# EAGLE design minutka_hlavni_v2 (EAGLE 9.6.2)
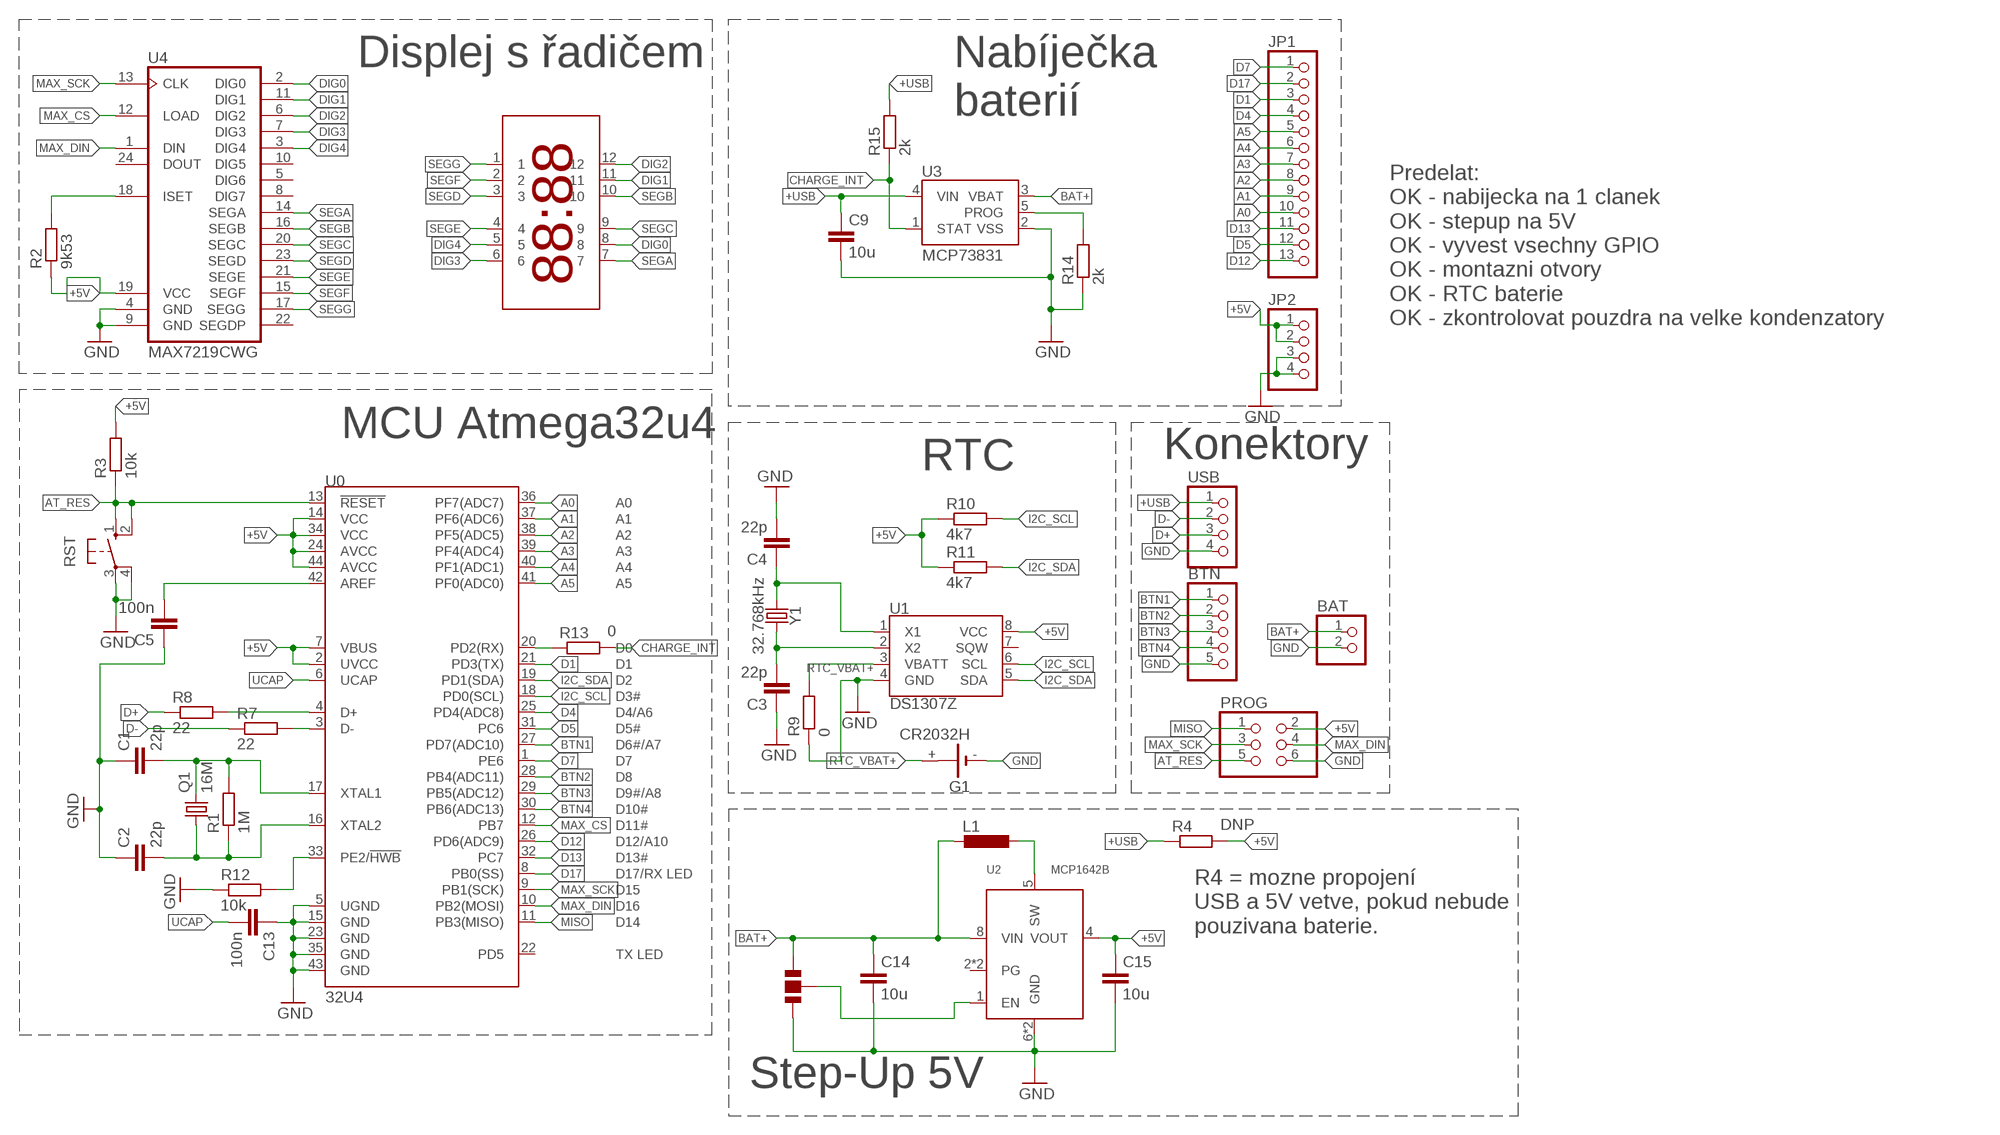
[diagram p0: schematic, sheet 1]

## Parts
BAT  PINHD-1X2  [1X02]
BTN  PINHD-1X5  [1X05]
C1  22p  C-EUC0603  [C0603]
C2  22p  C-EUC0603  [C0603]
C3  22p  C-EUC0603  [C0603]
C4  22p  C-EUC0603  [C0603]
C5  100n  C-EUC0603  [C0603]
C9  10u  C-EUC1206  [C1206]
C13  100n  C-EUC0603  [C0603]
C14  10u  C-EUC1206  [C1206]
C15  10u  C-EUC1206  [C1206]
G1  CR2032H  [CR2032H]
JP1  PINHD-1X13  [1X13]
JP2  PINHD-1X4  [1X04]
L1  L-EUL4532P  [L4532P]
PROG  PINHD-2X3  [2X03]
Q1  16M  CRYSTALHC49UP  [HC49UP]
R1  1M  R-EU_R0603  [R0603]
R2  9k53  R-EU_R0603  [R0603]
R3  10k  R-EU_R0603  [R0603]
R4  DNP  R-EU_R0603  [R0603]
R7  22  R-EU_R0603  [R0603]
R8  22  R-EU_R0603  [R0603]
R9  0  R-EU_R0603  [R0603]
R10  4k7  R-EU_R0603  [R0603]
R11  4k7  R-EU_R0603  [R0603]
R12  10k  R-EU_R0603  [R0603]
R13  0  R-EU_R0603  [R0603]
R14  2k  R-EU_R0603  [R0603]
R15  2k  R-EU_R0603  [R0603]
RST  10-XX  [B3F-10XX]
U0  32U4  ATMEGA32U4TQFP-44  [TQFP44]
U1  DS1307Z  [SO08-0.15]
U2  MCP1642B  [MSOP8]
U3  MCP73831  [SOT95P290X120-5]
U4  MAX7219CWG  [SO24L]
U$2  KW4-8828AVB  [KW4-8828AVB]
U$7  JUMPER  [2-WAY]
USB  PINHD-1X4  [1X04]
Y1  32.768kHz  CRYSTAL-32.768KHZSMD-2X6  [CRYSTAL-SMD-2X6-CYL]

## Nets
+5V: C15.1 JP2.1 JP2.2 PROG.2 R2.1 R3.2 R4.2 R10.1 R11.1 U0.2(UVCC) U0.7(VBUS) U0.14(VCC) U0.24(AVCC) U0.34(VCC) U0.44(AVCC) U1.8(VCC) U2.4(VOUT) U4.19(VCC)
+USB: C9.1 R4.1 R15.2 U3.4(VIN) USB.1
A0: JP1.10 U0.36(PF7(ADC7))
A1: JP1.9 U0.37(PF6(ADC6))
A2: JP1.8 U0.38(PF5(ADC5))
A3: JP1.7 U0.39(PF4(ADC4))
A4: JP1.6 U0.40(PF1(ADC1))
A5: JP1.5 U0.41(PF0(ADC0))
AT_RES: PROG.5 R3.1 RST.1(S) RST.2(S1) U0.13(!RESET)
BAT+: BAT.1 C14.1 L1.2 U2.8(VIN) U3.3(VBAT) U$7.P$2
BTN1: BTN.1 U0.27(PD7(ADC10))
BTN2: BTN.2 U0.28(PB4(ADC11))
BTN3: BTN.3 U0.29(PB5(ADC12))
BTN4: BTN.4 U0.30(PB6(ADC13))
CHARGE_INT: R13.2 R15.1 U3.1(STAT)
D1: JP1.3 U0.21(PD3(TX))
D4: JP1.4 U0.25(PD4(ADC8))
D5: JP1.12 U0.31(PC6)
D7: JP1.1 U0.1(PE6)
D12: JP1.13 U0.26(PD6(ADC9))
D13: JP1.11 U0.32(PC7)
D17: JP1.2 U0.8(PB0(SS))
D+: R8.1 USB.3
D-: R7.1 USB.2
DIG0: U4.2(DIG0) U$2.8
DIG1: U4.11(DIG1) U$2.11
DIG2: U4.6(DIG2) U$2.12
DIG3: U4.7(DIG3) U$2.6
DIG4: U4.3(DIG4) U$2.5
GND: BAT.2 BTN.5 C1.1 C2.1 C3.1 C4.2 C5.1 C9.2 C13.1 C14.2 C15.2 G1.- JP2.3 JP2.4 PROG.6 R9.1 R12.1 R14.1 RST.3(P) RST.4(P1) U0.5(UGND) U0.15(GND) U0.23(GND) U0.35(GND) U0.43(GND) U1.4(GND) U2.6(GND) U2.7(GND) U3.2(VSS) U4.4(GND) U4.9(GND) U$7.P$3 USB.4
I2C_SCL: R10.2 U0.18(PD0(SCL)) U1.6(SCL)
I2C_SDA: R11.2 U0.19(PD1(SDA)) U1.5(SDA)
MAX_CS: U0.12(PB7) U4.12(LOAD)
MAX_DIN: PROG.4 U0.10(PB2(MOSI)) U4.1(DIN)
MAX_SCK: PROG.3 U0.9(PB1(SCK)) U4.13(CLK)
MISO: PROG.1 U0.11(PB3(MISO))
N$1: C1.2 Q1.2 R1.2 U0.17(XTAL1)
N$2: C2.2 Q1.1 R1.1 U0.16(XTAL2)
N$3: C4.1 U1.1(X1) Y1.X1
N$4: C3.2 U1.2(X2) Y1.X2
N$7: R2.2 U4.18(ISET)
N$8: C5.2 U0.42(AREF)
N$10: R8.2 U0.4(D+)
N$11: R7.2 U0.3(D-)
N$13: R12.2 U0.33(PE2/!HWB)
N$17: R13.1 U0.20(PD2(RX))
N$18: R14.2 U3.5(PROG)
N$21: L1.1 U2.5(SW)
N$23: U2.1(EN) U$7.P$1
RTC_VBAT+: G1.+ R9.2 U1.3(VBATT)
SEGA: U4.14(SEGA) U$2.7
SEGB: U4.16(SEGB) U$2.10
SEGC: U4.20(SEGC) U$2.9
SEGD: U4.23(SEGD) U$2.3
SEGE: U4.21(SEGE) U$2.4
SEGF: U4.15(SEGF) U$2.2
SEGG: U4.17(SEGG) U$2.1
UCAP: C13.2 U0.6(UCAP)
Unconnected: G1.+@1(+) U0.22(PD5) U1.7(SQW) U2.2(PG) U2.3(PG) U4.5(DIG6) U4.8(DIG7) U4.10(DIG5) U4.22(SEGDP) U4.24(DOUT)

## Notes on the sheet
- Displej s řadičem
- Nabíječka
  baterií
- Predelat:
  OK - nabijecka na 1 clanek
  OK - stepup na 5V
  OK - vyvest vsechny GPIO
  OK - montazni otvory
  OK - RTC baterie
  OK - zkontrolovat pouzdra na velke kondenzatory
- MCU Atmega32u4
- RTC | Konektory
- R4 = mozne propojení
  USB a 5V vetve, pokud nebude
  pouzivana baterie.
- Step-Up 5V

## Library data of the parts
BAT = pinhead:PINHD-1X2: PIN HEADER
BTN = pinhead:PINHD-1X5: PIN HEADER
C1-C5 C9 C13-C15 = rcl:C-EU: CAPACITOR, European symbol; SPICEPREFIX: C
G1 = battery:CR2032H: LI BATTERY Varta
JP1 = pinhead:PINHD-1X13: PIN HEADER
JP2 USB = pinhead:PINHD-1X4: PIN HEADER
L1 = rcl:L-EU: INDUCTOR, European symbol; SPICEPREFIX: L
PROG = pinhead:PINHD-2X3: PIN HEADER
Q1 = crystal:CRYSTAL: CRYSTAL; OC_FARNELL: unknown; OC_NEWARK: unknown
R1-R4 R7-R15 = rcl:R-EU_: RESISTOR, European symbol; SPICEPREFIX: R
RST = switch-omron:10-XX: OMRON SWITCH; MPN: B3F-1000; OC_FARNELL: 176432; OC_NEWARK: 36M3542
U0 = SparkFun-IC-Microcontroller:ATMEGA32U4: Atmel MCU, 32KByte Atmel 44-pin 8-bit Microcontroller with 32KBytes of ISP Flash and USB Controller Datasheet <http://cdn.sparkfun.com/datasheets/Dev/Arduino/Boards/ATMega32U4.pdf> SparkFun Products LilyPad Arduino USB - ATmega32U4 Board <https://www.sparkfun.com/products/12049> (DEV-12049) Pro Micro - 5V/16MHz <https://www.sparkfun.com/products/12640> (DEV-12640) Pro Micro - 3.3V/8MHz <https://www.sparkfun.com/products/12587> (DEV-12587) Fio v3 - ATmega32U4 <https://www.sparkfun.com/products/11520> (DEV-11520) Qduino Mini <https://www.sparkfun.com/products/13614> (DEV-13614) Makey Makey - Standard Kit <https://www.sparkfun.com/products/11511> (WIG-11511) Makey Makey Deluxe Kit <https://www.sparkfun.com/products/11519> (WIG-11519); PROD_ID: IC-11161
U1 = SparkFun-Clocks:DS1307: Maxim DS1307 - I2C Real-time clock (RTC) The DS1307 serial real-time clock (RTC) is a low-power, full binary-coded decimal (BCD) clock/calendar plus 56 bytes of NV SRAM. Address and data are transferred serially through an I2C, bidirectional bus. The clock/calendar provides seconds, minutes, hours, day, date, month, and year information. SparkFun Products: Real Time Clock Module <https://www.sparkfun.com/products/12708> (BOB-12708) Datasheet <https://cdn.sparkfun.com/datasheets/BreakoutBoards/DS1307.pdf>; PROD_ID: IC-08138
U2 = bastlir:MCP1642B
U3 = bastlir:MCP73831
U4 = bastlir:MAX7219CWG
U$2 = bastlir:KW4-8828AVB: Displej sedmisegmentový 4 číslice 0,94" https://www.tme.eu/cz/details/kw4-8828avb/ctyrmistne-led-displeje/lucky-light/
U$7 = czech_maker:JUMPER
Y1 = SparkFun-Clocks:CRYSTAL-32.768KHZ: 32.768kHz Crystal Frequency: 32.768kHz Frequency Stability: ±20ppm Load Capacitance: 12.5pF (PTH-2X6 & SMD-3.2X1.5), 6pF (SMD-2X6) SparkFun Products: SparkFun BigTime Watch Kit <https://www.sparkfun.com/products/11734> SparkFun nRF52832 Breakout <https://www.sparkfun.com/products/13990> SparkFun Real Time Clock Module <https://www.sparkfun.com/products/12708>; PROD_ID: XTAL-07894

## Board
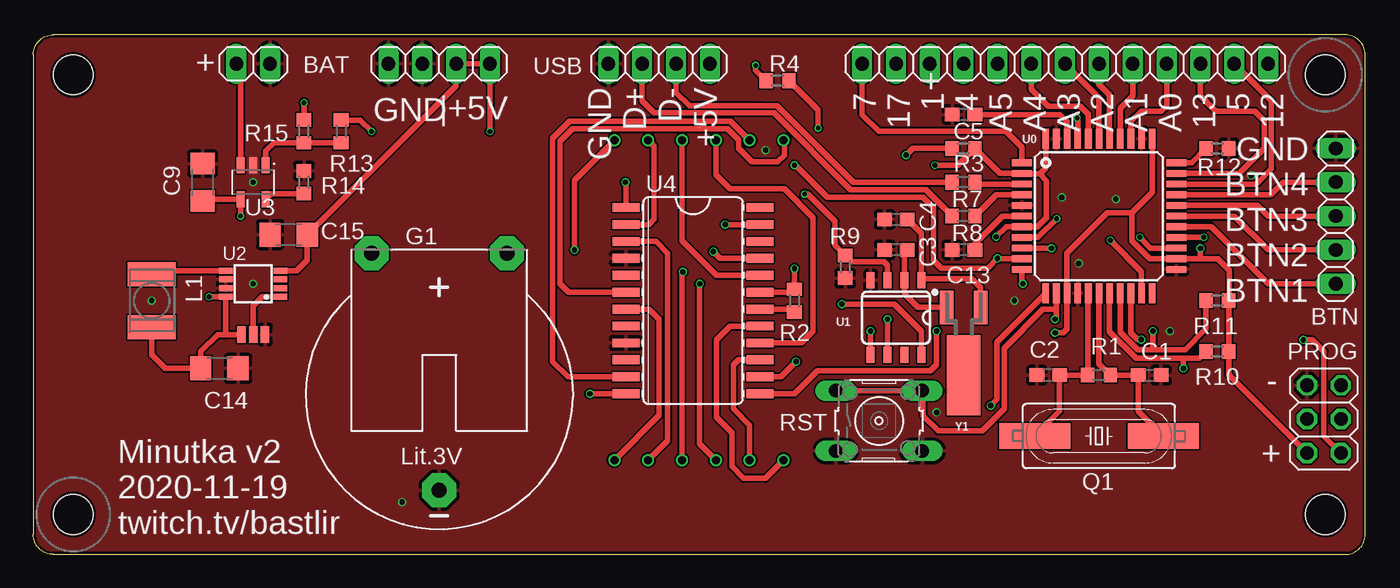
[diagram p1: board, top side]
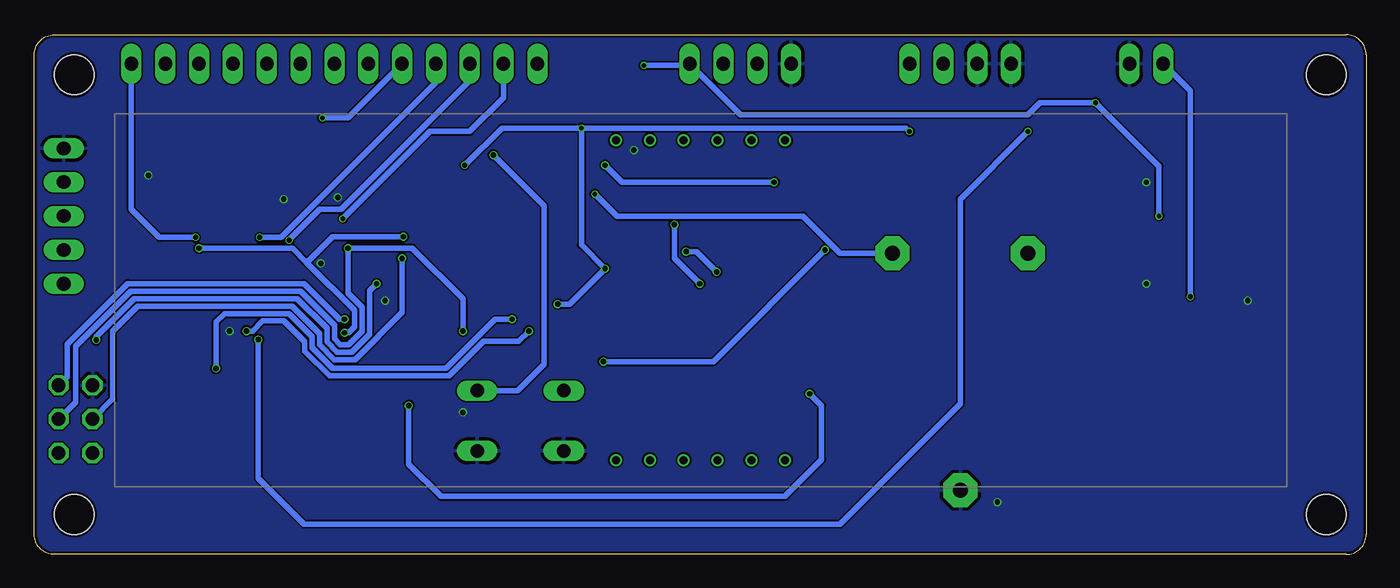
[diagram p2: board, bottom side, seen from below]

Size 100 x 39 mm. Coordinates in mm from the lower left corner, seen from the top.
Outline: 1.5,0 98.5,0 arc90 100,1.5 100,37.5 arc90 98.5,39 1.5,39 arc90 0,37.5 0,1.5 arc90 1.5,0
Copper layers (1*16): Top 0.035559375mm / dielectric 1.6mm / Bottom 0.035559375mm
Design rules "jlcpcb2layer": minimum track width 5mil, minimum drill 12mil, track to track 5mil, track to pad 5mil, pad to pad 5mil, via to via 5mil, smd to smd 5mil, copper to edge 8mil, drill to drill 6mil, minimum pad ring 5mil, minimum via ring 3mil, stop-mask expansion 2.5mil, vias tented up to drill 0mil, thermal gap 10mil
Holes 3 mm at 3,3 3,36 97,36 97,3

### Footprints (pad centres in the part's own frame; a part is rotated, then mirrored left to right if it is on the bottom)
1X02 = drill 1.016 long: 1 -1.27,0; 2 1.27,0
1X05 = drill 1.016 long: 1 -5.08,0; 2 -2.54,0; 3 0,0; 4 2.54,0; 5 5.08,0
C0603 = smd 1.1 x 1: 1 -0.85,0; 2 0.85,0
C1206 = smd 1.6 x 1.8: 1 -1.4,0; 2 1.4,0
CR2032H = drill 1.118 pad 2.54 octagon: + 5.08,10.795; +@1 -5.08,10.795; - 0,-6.985
1X13 = drill 1.016 long: 1 -15.24,0; 2 -12.7,0; 3 -10.16,0; 4 -7.62,0; 5 -5.08,0; 6 -2.54,0; 7 0,0; 8 2.54,0; 9 5.08,0; 10 7.62,0; 11 10.16,0; 12 12.7,0; 13 15.24,0
1X04 = drill 1.016 long: 1 -3.81,0; 2 -1.27,0; 3 1.27,0; 4 3.81,0
L4532P = smd 1.8 x 3.6: 1 -2,0; 2 2,0
2X03 = drill 1.016 octagon: 1 -2.54,-1.27; 2 -2.54,1.27; 3 0,-1.27; 4 0,1.27; 5 2.54,-1.27; 6 2.54,1.27
HC49UP = smd 5.334 x 1.93: 1 -4.826,0; 2 4.826,0
R0603 = smd 1 x 1.1: 1 -0.85,0; 2 0.85,0
B3F-10XX = drill 1.016 long: 1 -3.251,2.261; 2 3.251,2.261; 3 -3.251,-2.261; 4 3.251,-2.261
TQFP44 = smd 1.5 x 0.5: 1 -5.8,4; 2 -5.8,3.2; 3 -5.8,2.4; 4 -5.8,1.6; 5 -5.8,0.8; 6 -5.8,0; 7 -5.8,-0.8; 8 -5.8,-1.6; 9 -5.8,-2.4; 10 -5.8,-3.2; 11 -5.8,-4; 23 5.8,-4; 24 5.8,-3.2; 25 5.8,-2.4; 26 5.8,-1.6; 27 5.8,-0.8; 28 5.8,0; 29 5.8,0.8; 30 5.8,1.6; 31 5.8,2.4; 32 5.8,3.2; 33 5.8,4 | smd 0.5 x 1.5: 12 -4,-5.8; 13 -3.2,-5.8; 14 -2.4,-5.8; 15 -1.6,-5.8; 16 -0.8,-5.8; 17 0,-5.8; 18 0.8,-5.8; 19 1.6,-5.8; 20 2.4,-5.8; 21 3.2,-5.8; 22 4,-5.8; 34 4,5.8; 35 3.2,5.8; 36 2.4,5.8; 37 1.6,5.8; 38 0.8,5.8; 39 0,5.8; 40 -0.8,5.8; 41 -1.6,5.8; 42 -2.4,5.8; 43 -3.2,5.8; 44 -4,5.8
SO08-0.15 = smd 0.6 x 1.2: 1 -1.905,-2.8; 2 -0.635,-2.8; 3 0.635,-2.8; 4 1.905,-2.8; 5 1.905,2.8; 6 0.635,2.8; 7 -0.635,2.8; 8 -1.905,2.8
MSOP8 = smd 0.45 x 1: 1 -0.975,-2.05; 2 -0.325,-2.05; 3 0.325,-2.05; 4 0.975,-2.05; 5 0.975,2.05; 6 0.325,2.05; 7 -0.325,2.05; 8 -0.975,2.05
SOT95P290X120-5 = smd 1.18 x 0.609: 1 -1.274,0.95; 2 -1.274,0; 3 -1.274,-0.95; 4 1.274,-0.95; 5 1.274,0.95
SO24L = smd 0.66 x 2.032: 1 -6.985,-5.029; 2 -5.715,-5.029; 3 -4.445,-5.029; 4 -3.175,-5.029; 5 -1.905,-5.029; 6 -0.635,-5.029; 7 0.635,-5.029; 8 1.905,-5.029; 9 3.175,-5.029; 10 4.445,-5.029; 11 5.715,-5.029; 12 6.985,-5.029; 13 6.985,5.029; 14 5.715,5.029; 15 4.445,5.029; 16 3.175,5.029; 17 1.905,5.029; 18 0.635,5.029; 19 -0.635,5.029; 20 -1.905,5.029; 21 -3.175,5.029; 22 -4.445,5.029; 23 -5.715,5.029; 24 -6.985,5.029
KW4-8828AVB = drill 0.6: 1 -6.8,-11.97; 2 -4.26,-11.97; 3 -1.72,-11.97; 4 0.82,-11.97; 5 3.36,-11.97; 6 5.9,-11.97; 7 5.9,12.03; 8 3.36,12.03; 9 0.82,12.03; 10 -1.72,12.03; 11 -4.26,12.03; 12 -6.8,12.03
2-WAY = smd 0.635 x 1.27: P$1 0,0; P$2 0.889,0; P$3 -0.889,0
CRYSTAL-SMD-2X6-CYL = smd 2.5 x 6: SHEILD 0,5.08 | smd 1 x 2.5: X1 -1.27,0; X2 1.27,0

### Placement (x,y rotation side)
BAT  16.51,36.83 0 top
BTN  97.79,25.4 90 top
C1  83.82,13.46 180 top
C2  76.2,13.46 0 top
C3  64.77,22.86 0 top
C4  64.77,25.15 180 top
C5  69.85,33.02 0 top
C9  12.7,27.94 90 top
C13  69.85,22.86 0 top
C14  13.97,13.97 0 top
C15  19.18,24 180 top
G1  30.48,11.81 0 top
JP1  77.47,36.83 0 top
JP2  30.48,36.83 180 top
L1  8.89,19.05 270 top
PROG  96.9,10.16 90 top
Q1  80.01,8.89 0 top
R1  80.01,13.46 0 top
R2  57.15,19.05 270 top
R3  69.85,30.48 0 top
R4  55.88,35.56 0 top
R7  69.85,27.94 0 top
R8  69.85,25.4 0 top
R9  60.96,21.59 90 top
R10  88.9,15.24 180 top
R11  88.9,19.05 180 top
R12  88.9,30.48 180 top
R13  23.11,31.75 270 top
R14  20.32,27.94 270 top
R15  20.32,31.75 90 top
RST  63.5,10.03 0 top
U0  80.01,25.4 0 top
U1  64.77,17.78 180 top
U2  16.51,20.32 90 top
U3  16.51,27.94 270 top
U4  49.53,19.05 270 top
U$2  49.53,19.05 0 bottom
U$7  16.51,16.51 180 top
USB  46.99,36.83 180 top
Y1  69.85,18.54 180 top

### Tracks (layer width: path | path; a pad name or v marks a point on that pad's centre or on a via)
+5V  (via drill 0.35, 0.4)
  Top 0.406: U4.19 56.94,19.68 R2.1 v57.15,21.46 | U1.8 66.67,16.76 64.64,18.8 v60.71,18.8 | 87.63,22.2 U0.24 83.84,22.2 82.49,23.56 82.49,25.65 | 87.63,22.2 88.92,22.2 89.79,21.34 89.79,19.09 R11.1 R10.1 89.75,13.5 PROG.2 | v76.71,16.64 77.34,16.64 77.61,16.9 U0.14 77.61,22.62 80.64,25.65 82.49,25.65 | v87.63,22.99 87.63,22.2 | U0.44 76.01,29.02 75.56,28.57 | 75.56,28.57 74.23,28.57 U0.2 72.58,28.6 R3.2 69.43,29.21 v67.69,29.21 | 75.56,28.57 76.07,28.07 76.07,25.27 75.4,24.6 U0.7 73.04,24.6 v72.29,23.85 | U0.34 84.01,27.18 82.49,25.65 | U2.4 19.77,21.3 20.58,22.1 C15.1 31.75,35.18 JP2.2 JP2.1 v34.29,31.75 | R4.2 58.93,33.36 v58.93,32
  Bottom 0.406: v60.71,18.8 59.82,18.8 v57.15,21.46 58.93,23.24 v58.93,32 | 79.54,21.91 75.95,18.32 75.95,17.09 76.4,16.64 v76.71,16.64 | 79.54,21.91 80.62,22.99 v87.63,22.99 | v72.29,23.85 77.6,23.85 79.54,21.91 | v34.29,31.75 34.54,32 v58.93,32 | v58.93,32 64.9,32 v67.69,29.21
+USB  (via drill 0.35)
  Top 0.406: C9.1 12.82,26.67 U3.4 v15.56,25.4 | R4.1 54.23,36.36 v54.23,36.7 | R15.2 v20.32,33.91
  Bottom 0.406: v54.23,36.7 50.93,36.7 USB.1 46.99,33.02 25.4,33.02 24.51,33.91 v20.32,33.91 15.56,29.15 v15.56,25.4
A0
  Top 0.406: JP1.10 85.09,33.66 84.71,33.27 83.19,33.27 82.41,32.5 U0.36
A1
  Top 0.406: JP1.9 82.55,34.42 81.61,33.48 U0.37
A2
  Top 0.406: JP1.8 80.01,35.31 80.81,34.51 U0.38
A3
  Top 0.406: JP1.7 80.01,34.29 U0.39
A4
  Top 0.406: U0.40 79.21,33.06 78.61,33.66 76.2,33.66 74.93,34.92 JP1.6
A5  (via drill 0.35)
  Top 0.406: U0.41 78.41,32.72 v78.36,32.77
  Bottom 0.406: v78.36,32.77 76.45,32.77 JP1.5
AT_RES  (via drill 0.4)
  Top 0.406: U0.13 76.81,18.41 | 76.81,18.41 76.81,17.75 v76.71,17.65 | R3.1 66.04,30.48 v65.53,29.97 | RST.1 RST.2 66.8,12.24 66.8,10.41 67.94,9.27 71.25,9.27 72.9,10.92 72.9,15.49 75.82,18.41 76.81,18.41
  Bottom 0.406: v76.71,17.65 77.09,17.65 79.76,20.32 92.99,20.32 97.54,15.78 97.54,13.34 PROG.5 | v65.53,29.97 61.72,26.16 61.72,14.28 63.7,12.29 RST.2
BAT+  (via drill 0.35)
  Top 0.406: L1.2 8.89,14.99 9.91,13.97 C14.1 12.57,15.24 13.84,16.51 14.61,16.51 | U$7.P$2 14.61,16.51 | 14.61,16.51 14.46,16.66 U2.8 v13.21,19.34 | U3.3 15.56,36.51 BAT.1
  Bottom 0.406: v13.21,19.34 13.21,34.8 BAT.1
BTN1
  Top 0.406: U0.27 88.43,24.6 92.71,20.32 BTN.1
BTN2
  Top 0.406: U0.28 90.17,25.4 92.71,22.86 BTN.2
BTN3
  Top 0.406: U0.29 91.91,26.2 92.71,25.4 BTN.3
BTN4
  Top 0.406: U0.30 92.91,27 93.85,27.94 BTN.4
CHARGE_INT
  Top 0.406: U3.1 17.46,30.29 18.07,30.9 R15.1 R13.2
D1  (via drill 0.35)
  Top 0.406: U0.21 83.21,21.23 v80.86,23.58
  Bottom 0.406: v80.86,23.58 80.86,23.62 78.58,25.91 76.97,25.91 67.31,35.56 JP1.3
D4  (via drill 0.35)
  Top 0.406: U0.25 83.88,23 v83.08,23.8
  Bottom 0.406: v83.08,23.8 81.48,23.8 69.85,35.43 JP1.4
D5
  Top 0.406: U0.31 91.81,27.8 92.96,28.96 92.96,34.04 JP1.12
D7
  Top 0.406: U0.1 74.21,30.57 73.03,31.75 63.5,31.75 62.23,33.02 JP1.1
D12  (via drill 0.35)
  Top 0.406: v87.88,23.8 U0.26
  Bottom 0.406: v87.88,23.8 90.61,23.8 92.71,25.91 JP1.13
D13
  Top 0.406: U0.32 90.55,28.6 92.43,30.48 92.43,32.55 91.7,33.27 88.77,33.27 87.63,34.42 JP1.11
D17  (via drill 0.35)
  Top 0.406: U0.8 75.43,23.8 v76.83,25.2
  Bottom 0.406: v76.83,25.2 70.29,31.75 67.31,31.75 64.77,34.29 JP1.2
D+
  Top 0.406: R8.1 67.02,27.38 61.36,27.38 55.6,33.15 46.61,33.15 45.72,34.04 USB.3
D-
  Top 0.406: R7.1 61.56,27.94 55.82,33.68 54.61,33.68 54.2,33.68 49.25,33.68 48.26,34.67 USB.2
DIG0
  Top 0.406: U4.2 46.23,24.77 46.61,25.15 46.61,30.64 U$2.8
DIG1
  Top 0.406: U$2.11 52.36,32.51 40.26,32.51 38.99,31.24 38.99,14.48 40.13,13.34 U4.11
DIG2
  Top 0.406: U4.6 40.18,19.68 39.55,20.32 39.55,31.01 40.49,31.95 52.12,31.95 52.96,31.11 52.96,30.48 53.98,29.46 55.88,29.46 56.39,29.97 56.39,31.02 U$2.12
DIG3
  Top 0.406: U4.7 46.23,18.41 46.99,17.65 46.99,10.44 U$2.6
DIG4
  Top 0.406: U4.3 46.74,23.5 47.62,22.61 47.62,8.54 U$2.5
GND  (via drill 0.4)
  other vias: 81.28,26.67 67.82,10.67 85.34,16.76 77.22,26.8 73.66,19.05 78.49,21.84 27.69,3.94 16.51,20.32 16.51,27.94 8.89,19.05 54.99,30.35 91.44,28.45
  pour Top: -0.38,-0.38 101.6,-0.38 101.6,39.75 -0.38,39.75
  pour Bottom: -0.64,-0.76 102.87,-0.76 102.87,40.13 -0.64,40.13
I2C_SCL  (via drill 0.4)
  Top 0.406: U0.18 80.81,16.73 82.8,14.73 86.36,14.73 | R10.2 87.54,14.73 86.36,14.73 | 86.36,14.73 v86.36,13.97 | v64.14,17.65 U1.6
  Bottom 0.406: v86.36,13.97 86.36,17.45 85.72,18.09 80.88,18.09 79.14,16.35 79.14,15.5 77.61,13.97 69.09,13.97 65.41,17.65 v64.14,17.65
I2C_SDA  (via drill 0.4)
  Top 0.406: U0.19 81.61,16.69 82.93,15.37 84.07,15.37 | 84.07,15.37 86.49,15.37 88.05,16.93 R11.2 | v84.07,16.76 84.07,15.37 | v62.87,16.76 U1.5
  Bottom 0.406: v84.07,16.76 83.62,16.76 82.86,17.53 81.28,17.53 79.7,15.95 79.7,15.27 77.84,13.41 68.86,13.41 66.27,16 63.63,16 v62.87,16.76
MAX_CS  (via drill 0.4)
  Top 0.406: v41.78,12.06 U4.12 | U0.12 72.34,15.93 72.34,11.63 v71.88,11.18
  Bottom 0.406: v41.78,12.06 40.89,11.18 40.89,7.11 43.64,4.37 69.47,4.37 71.88,6.78 v71.88,11.18
MAX_DIN  (via drill 0.4)
  Top 0.406: U0.10 72.42,22.2 v72.39,22.23 71.66,21.5 68.18,21.5 67.59,22.09 67.59,26.01 66.78,26.82 59.61,26.82 57.22,29.21 v57.15,29.21 | U4.1 44.5,27.89 v44.45,27.94
  Bottom 0.406: PROG.4 94.11,11.68 94.11,16.76 92.23,18.64 80.64,18.64 78.58,16.58 78.58,15.73 77.48,14.63 75.93,14.63 72.39,18.17 v72.39,22.22 v72.39,22.23 | v57.15,29.21 55.88,27.94 v44.45,27.94
MAX_SCK  (via drill 0.4)
  Top 0.406: v76.45,22.99 74.22,22.99 U0.9 | U4.13 57.15,12.06 58.86,13.78 67.37,13.78 67.82,14.22 v67.82,16.76
  Bottom 0.406: PROG.3 96.9,11.43 96.9,15.62 92.76,19.76 80.01,19.76 77.47,17.22 77.47,16.2 77.02,15.75 76.39,15.75 75.39,16.75 75.39,18.55 76.45,19.61 v76.45,22.99 71.63,22.99 67.82,19.18 v67.82,16.76
MISO  (via drill 0.4)
  Top 0.406: PROG.1 96.9,8.89 96.9,15.24 96.04,16.1 v95.35,16.1 | v74.3,20.32 74.21,20.41 U0.11
  Bottom 0.406: v95.35,16.1 95.35,16.35 92.5,19.2 80.26,19.2 78.03,16.96 78.03,15.96 77.25,15.19 76.16,15.19 74.83,16.52 74.83,19.78 v74.3,20.32
N$1
  Top 0.406: Q1.2 82.97,10.76 C1.2 R1.2 80.01,14.31 U0.17
N$2
  Top 0.406: Q1.1 77.05,10.76 C2.2 R1.1 79.16,19.55 U0.16
N$3
  Top 0.406: C4.1 66.67,24.09 U1.1 66.8,20.7 70.48,20.7 71.12,20.07 Y1.X1
N$4
  Top 0.406: C3.2 65.41,22.64 U1.2 65.41,19.56 66.42,18.54 Y1.X2
N$7
  Top 0.406: U4.18 56.94,18.41 R2.2
N$8
  Top 0.406: U0.42 77.61,32.5 77.09,33.02 C5.2
N$10
  Top 0.406: U0.4 72.3,27 R8.2
N$11
  Top 0.406: U0.3 70.84,27.8 R7.2
N$13
  Top 0.406: U0.33 86.97,29.4 R12.2
N$17  (via drill 0.35, 0.4)
  Top 0.406: U0.20 82.41,16.65 82.93,16.13 v83.19,16.13 | R13.1 24.55,32.6 v25.4,31.75
  Bottom 0.406: v83.19,16.13 83.19,5.71 79.76,2.29 39.5,2.29 30.48,11.3 30.48,26.67 v25.4,31.75
N$18
  Top 0.406: U3.5 17.88,27.09 R14.2
N$21
  Top 0.406: L1.1 9.13,21.3 U2.5
N$23
  Top 0.406: U$7.P$1 16.51,18.67 17.19,19.34 U2.1
RTC_VBAT+  (via drill 0.35)
  Top 0.406: U1.3 64.14,21.72 63.88,21.97 61.43,21.97 R9.2 60.2,23.2 60.2,25.02 58.17,27.05 v57.91,27.05
  Bottom 0.406: G1.+ 39.49,22.61 42.28,25.39 56.26,25.39 v57.91,27.05
SEGA  (via drill 0.4)
  Top 0.406: U4.14 56.13,13.34 v57.28,14.48 | v40.64,22.86 40.64,28.09 U$2.7
  Bottom 0.406: v57.28,14.48 49.02,14.48 v40.64,22.86
SEGB
  Top 0.406: U4.16 57.66,15.88 58.55,16.76 58.55,25.27 56.39,27.43 52.32,27.43 51.25,28.51 U$2.10
SEGC
  Top 0.406: U$2.9 48.71,23.55 51.31,20.95 U4.20
SEGD  (via drill 0.4)
  Top 0.406: U$2.3 50.04,8.29 v50.04,20.32 | v51.94,24.77 U4.23
  Bottom 0.406: v50.04,20.32 51.94,22.23 v51.94,24.77
SEGE  (via drill 0.4)
  Top 0.406: U$2.4 48.71,21.15 v48.77,21.21 | v51.05,22.73 51.56,22.23 U4.21
  Bottom 0.406: v48.77,21.21 50.29,22.73 v51.05,22.73
SEGF
  Top 0.406: U$2.2 53.79,9.71 52.58,10.92 52.58,14.22 52.96,14.61 U4.15
SEGG
  Top 0.406: U$2.1 54.97,5.71 53.34,5.71 52.45,6.6 52.45,9.14 51.31,10.29 51.31,16.13 52.32,17.14 U4.17
UCAP
  Top 0.406: U0.6 72.77,25.4 70.7,23.33 C13.2

### Text on the board
tNames: + | GND / D+ / D- / +5V | + | 7 / 17 / 1 / 4 / A5 / A4 / A3 / A2 / A1 / A0 / 13 / 5 / 12 | GND | |+5V | GND / BTN4 / BTN3 / BTN2 / BTN1 | - | + | Minutka v2 / 2020-11-19 / twitch.tv/bastlir